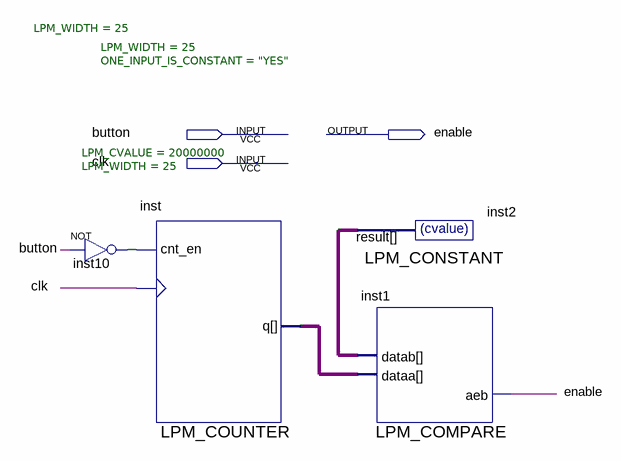
[diagram p0: schematic sheet]
// Quartus schematic gA6_debouncer.bdf as structural Verilog: 4 symbols, 3 pins
module gA6_debouncer (
  input  button,
  input  clk,
  output enable
);

  wire inst10_out;
  wire [24:0] inst2_result, inst_q;

  not inst10 (inst10_out, button);
  LPM_COUNTER #(.LPM_WIDTH(25)) inst (.clock(clk), .cnt_en(inst10_out), .q(inst_q));
  LPM_CONSTANT #(.LPM_CVALUE(20000000), .LPM_WIDTH(25)) inst2 (.result(inst2_result));
  LPM_COMPARE #(.LPM_WIDTH(25), .ONE_INPUT_IS_CONSTANT("YES")) inst1 (
    .dataa(inst_q), .datab(inst2_result), .aeb(enable));
endmodule
